# Altium schematic sheet LionIRVT-Power.SchDoc
size A3
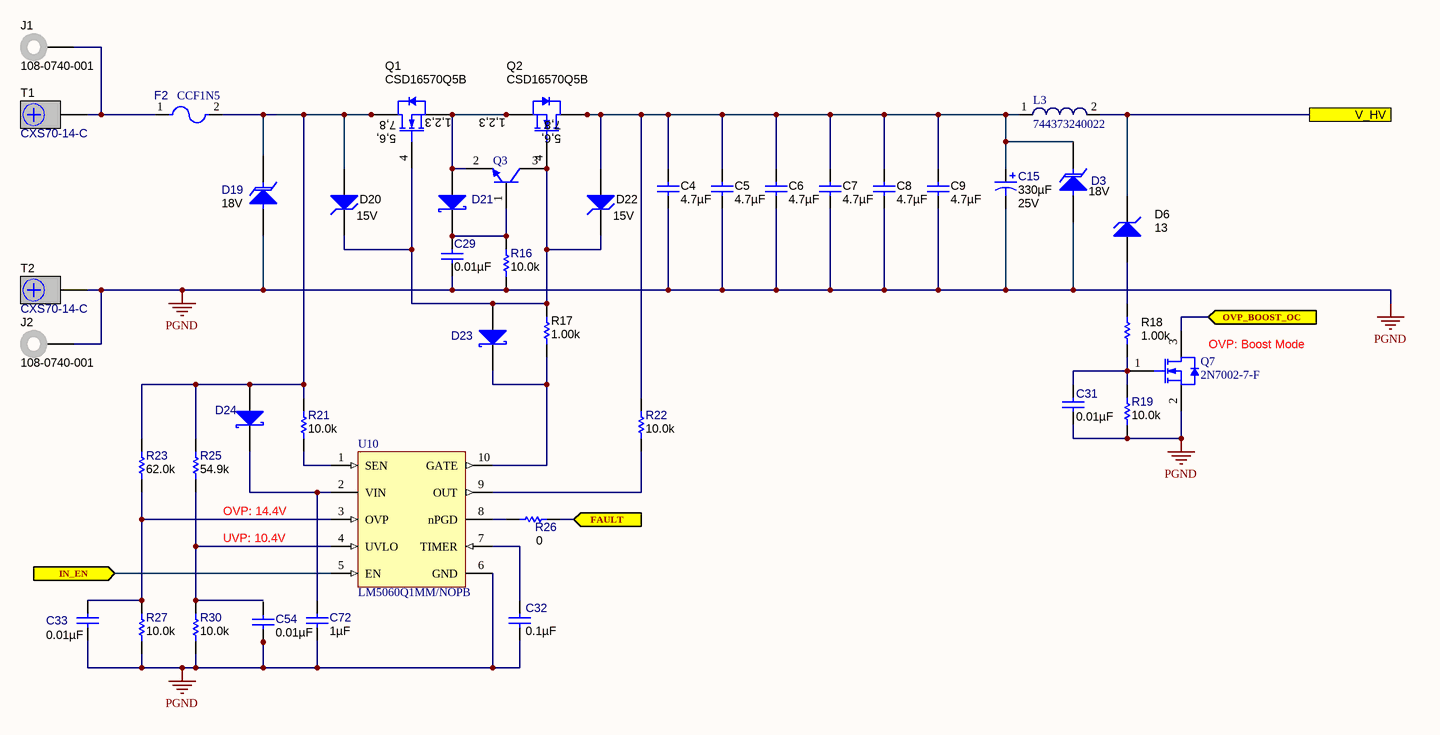
[diagram p0: LionIRVT-Power.SchDoc]

## Parts
C4  ValueDisplayed: 4.7µF  [2220_280]  (hidden comment: C5750X7R2A475M230KA)
C5  ValueDisplayed: 4.7µF  [2220_280]  (hidden comment: C5750X7R2A475M230KA)
C6  ValueDisplayed: 4.7µF  [2220_280]  (hidden comment: C5750X7R2A475M230KA)
C7  ValueDisplayed: 4.7µF  [2220_280]  (hidden comment: C5750X7R2A475M230KA)
C8  ValueDisplayed: 4.7µF  [2220_280]  (hidden comment: C5750X7R2A475M230KA)
C9  ValueDisplayed: 4.7µF  [2220_280]  (hidden comment: C5750X7R2A475M230KA)
C15  ValueDisplayed: 330µF  Value2: 25V  [CAPSMT_62_F12]  (hidden comment: 25SVPF330M)
C29  ValueDisplayed: 0.01µF  [0603C]  (hidden comment: GRM1885C1H103JA01D)
C31  ValueDisplayed: 0.01µF  [0603C]  (hidden comment: GRM1885C1H103JA01D)
C32  ValueDisplayed: 0.1µF  [0603C]  (hidden comment: C0603C104J3RACTU)
C33  ValueDisplayed: 0.01µF  [0603C]  (hidden comment: GRM1885C1H103JA01D)
C54  ValueDisplayed: 0.01µF  [0603C]  (hidden comment: GRM1885C1H103JA01D)
C72  ValueDisplayed: 1µF  [0603C]  (hidden comment: C0603C105K3RACTU)
D3  value 18V  [SMA]  (hidden comment: SMAJ18A)
D6  value 13  [sod-323]  (hidden comment: MMSZ5243BS-7-F)
D19  value 18V  [SMA]  (hidden comment: SMAJ18A)
D20  value 15V  [sod-323]  (hidden comment: MMSZ5245BS-7-F)
D21  NSR0240V2T1G  [SOD-523]  (value not drawn)
D22  value 15V  [sod-323]  (hidden comment: MMSZ5245BS-7-F)
D23  NSR0240V2T1G  [SOD-523]  (value not drawn)
D24  NSR0240V2T1G  [SOD-523]  (value not drawn)
F2  CCF1N5  [FUSE_CCF]
J1  108-0740-001  [Johnson_108-0740-001]
J2  108-0740-001  [Johnson_108-0740-001]
L3  744373240022  [WE-LHMI 4020]
Q1  CSD16570Q5B  [DNK8]
Q2  CSD16570Q5B  [DNK8]
Q3  MMBT2222ALT1G  [ONSC-SOT-23-3-318-08_V]  (value not drawn)
Q7  2N7002-7-F  [DIOD-SOT23-3_V]
R16  ValueDisplayed: 10.0k  [0603R]  (hidden comment: RC0603FR-0710KL)
R17  ValueDisplayed: 1.00k  [0603R]  (hidden comment: Resistor)
R18  ValueDisplayed: 1.00k  [0603R]  (hidden comment: Resistor)
R19  ValueDisplayed: 10.0k  [0603R]  (hidden comment: RC0603FR-0710KL)
R21  ValueDisplayed: 10.0k  [0603R]  (hidden comment: RC0603FR-0710KL)
R22  ValueDisplayed: 10.0k  [0603R]  (hidden comment: RC0603FR-0710KL)
R23  ValueDisplayed: 62.0k  [0603R]  (hidden comment: RC0603FR-0762KL)
R25  ValueDisplayed: 54.9k  [0603R]  (hidden comment: RC0603FR-0754K9L)
R26  ValueDisplayed: 0  [0603R]  (hidden comment: RC0603JR-070RL)
R27  ValueDisplayed: 10.0k  [0603R]  (hidden comment: RC0603FR-0710KL)
R30  ValueDisplayed: 10.0k  [0603R]  (hidden comment: RC0603FR-0710KL)
T1  CXS70-14-C  [Panduit_CXS70-14-C]
T2  CXS70-14-C  [Panduit_CXS70-14-C]
U10  LM5060Q1MM/NOPB  [DGS0010A_N]

## Ports
FAULT (in), IN_EN (in), OVP_BOOST_OC (in), V_HV

## Nets
PGND: C4.2 C5.2 C6.2 C7.2 C8.2 C9.2 C15.2(-) C29.2 C31.1 C32.1 C33.1 C54.1 C72.2 D3.2(A) D19.2(A) J2.1 Q7.2(S) R16.2 R19.2 R27.2 R30.2 T2.1 U10.6(GND)
FAULT: R26.1 ; port FAULT
IN_EN: U10.5(EN) ; port IN_EN
OVP_BOOST_OC: Q7.3(D) ; port OVP_BOOST_OC
V_HV: D6.1(K) L3.2 ; port V_HV
NetC4_1: C4.1 C5.1 C6.1 C7.1 C8.1 C9.1 C15.1(+) D3.1(K) D22.2(A) L3.1 Q2.5(D) Q2.6(D) Q2.7(D) Q2.8(D) R22.1
NetC29_1: C29.1 D21.1(K) Q3.1(B) R16.1
NetC31_2: C31.2 Q7.1(G) R18.1 R19.1
NetC32_2: C32.2 U10.7(TIMER)
NetC33_2: C33.2 R23.1 R27.1 U10.3(OVP)
NetC72_1: C72.1 D24.1(K) U10.2(VIN)
NetD6_2: D6.2(A) R18.2
NetD19_1: D19.1(K) D20.2(A) D24.2(A) F2.2 Q1.5(D) Q1.6(D) Q1.7(D) Q1.8(D) R21.1 R23.2 R25.2
NetD20_1: D20.1(K) D22.1(K) D23.2(A) Q1.4(G) Q2.4(G) Q3.3(C) R17.2
NetD21_2: D21.2(A) Q1.1(S) Q1.2(S) Q1.3(S) Q2.1(S) Q2.2(S) Q2.3(S) Q3.2(E)
NetD23_1: D23.1(K) R17.1 U10.10(GATE)
NetF2_1: F2.1 J1.1 T1.1
NetR21_2: R21.2 U10.1(SEN)
NetR22_2: R22.2 U10.9(OUT)
NetR25_1: R25.1 R30.1 U10.4(UVLO)
NetR26_2: R26.2 U10.8(nPGD)

Not connected (* = marked no-connect by the designer): C54 2

## Notes on the sheet
- (near Q7) OVP: Boost Mode
- (near R25) OVP: 14.4V
- UVP: 10.4V
- Title
- Size:
- Date:
- A3
- Number:
- Time:
- Revision:
- Sheet
- of
- File:
- (in symbol CSD16570Q5B) 7,8; 1,2,3; 5,6,

## Library data of the parts
C4-C9 = C5750X7R2A475M230KA: CAP, CERM, 4.7 µF, 100 V, +/- 20%, X7R, 2220; Manufacturer: TDK; Polarized: N; CompType: Capacitor; Value: 4.7uF; U/M: EA; Cap_F: 0.0000047; Tolerance_%: 20; ESR_ohm: 0.0015; Value1: 0.0015 ohm; VDC_V: 100; Value2: 100V; IRMS_A: 5.5; TaMin_C: -55; TaMax_C: 125; Cap_Case: 2220; AEC Category: Q200; SymbolVersion: 2008-07-09; PartNumber: C5750X7R2A475M230KA; PackageReference: 2220; RoHS: Y; MountType: SMT; Technology: Ceramic; TempCo: X7R; Published: 2008-06-19; Publisher: Texas Instruments; LatestRevisionDate: 2016-03-26; ComponentLink1Description: Datasheet link; ComponentLink1URL: http://www.tdk.co.jp/tefe02/e412_c.pdf; Supplier 1: Digi-Key; Supplier Part Number 1: 445-1450-1-ND; Supplier 2: Mouser; Supplier Part Number 2: 810-C5750X7R2A475M; Supplier 3: Farnell; Supplier Part Number 3: 1843193; AEC Qualified: N; AEC Grade: N/A
C15 = 25SVPF330M: CAP, Aluminum Polymer, 330 µF, 25 V, +/- 20%, 0.014 ohm, F12, SMD, 2-Leads, Body 10.5x10.5mm, Height 12.7mm SMD; Manufacturer: Panasonic; Polarized: Y; CompType: Capacitor; Value: 330uF; U/M: EA; Cap_F: 0.00033; Tolerance_%: 20; VDC_V: 25; ESR_ohm: 0.014; IRMS_A: 5; TaMin_C: -55; TaMax_C: 105; SizeAreaWB_mm2: 151.29; SizeArea_mm2: 106.09; SizeX_mm: 10.3; SizeZ_mm: 12.6; AEC Category: Q200; AEC Qualified: N; SymbolVersion: 2008-07-09; PartNumber: 25SVPF330M; PackageReference: F12, SMD, 2-Leads, Body 10.5x10.5mm, Height 12.7mm; RoHS: Y; Value1: 0.014 ohm; MountType: SMT; Technology: Aluminum Polymer; Series: SVPF; Cap_Case: F12; SizeY_mm: 10.3; Publisher: Texas Instruments; LatestRevisionDate: 2016-12-22; ComponentLink1Description: Datasheet link; ComponentLink1URL: http://industrial.panasonic.com/www-data/pdf/AAB8000/AAB8000CE1.pdf; AEC Grade: N/A
C29 C31 C33 C54 = GRM1885C1H103JA01D: CAP, CERM, 0.01 µF, 50 V, +/- 5%, C0G/NP0, 0603; Manufacturer: MuRata; Polarized: N; CompType: Capacitor; Value: 0.01uF; U/M: EA; Cap_F: 0.00000001; Tolerance_%: 5; Value1: Unknown; VDC_V: 50; Value2: 50V; TaMin_C: -55; TaMax_C: 125; Cap_Case: 0603; SizeArea_mm2: 1.28; SizeAreaWB_mm2: 4.68; SizeX_mm: 1.6; SizeY_mm: 0.8; SizeZ_mm: 1; AEC Category: Q200; SymbolVersion: 2008-07-09; PartNumber: GRM1885C1H103JA01D; PackageReference: 0603; RoHS: Y; MountType: SMT; Technology: Ceramic; TempCo: C0G/NP0; Published: 2008-06-19; Publisher: Texas Instruments; LatestRevisionDate: 2017-03-17; ComponentLink1Description: Datasheet link; ComponentLink1URL: http://search.murata.co.jp/Ceramy/image/img/A01X/G101/ENG/GRM1885C1H103JA01-01.pdf; Supplier 1: Digi-Key; Supplier Part Number 1: 490-9666-1-ND; Supplier 2: Newark; Supplier Part Number 2: 31Y1764; Supplier 3: Mouser; Supplier Part Number 3: 81-GRM1885C1H103JA1D; AEC Qualified: N; AEC Grade: N/A
C32 = C0603C104J3RACTU: CAP, CERM, 0.1 µF, 25 V, +/- 5%, X7R, 0603; Manufacturer: Kemet; Polarized: N; CompType: Capacitor; Value: 0.1uF; U/M: EA; Cap_F: 0.0000001; Tolerance_%: 5; Value1: Unknown; VDC_V: 25; Value2: 25V; TaMin_C: -55; TaMax_C: 125; Cap_Case: 0603; SizeArea_mm2: 1.28; SizeAreaWB_mm2: 4.68; SizeX_mm: 1.6; SizeY_mm: 0.8; SizeZ_mm: 1; AEC Category: Q200; SymbolVersion: 2008-07-09; PartNumber: C0603C104J3RACTU; PackageReference: 0603; RoHS: Y; MountType: SMT; Technology: Ceramic; TempCo: X7R; Published: 2008-06-19; Publisher: Texas Instruments; LatestRevisionDate: 2016-09-23; ComponentLink1Description: Datasheet link; ComponentLink1URL: http://www.kemet.com/kemet/web/homepage/kechome.nsf/vapubfiles/F3102_Y5V.pdf/$file/F3102_Y5V.pdf; Supplier 1: Digi-Key; Supplier Part Number 1: 399-1282-1-ND; Supplier 2: Mouser; Supplier Part Number 2: 80-C0603C104J3R; Supplier 3: Farnell; Supplier Part Number 3: 1650833; AEC Qualified: ?
C72 = C0603C105K3RACTU: CAP, CERM, 1 µF, 25 V, +/- 10%, X7R, 0603; Manufacturer: Kemet; Polarized: N; CompType: Capacitor; Value: 1uF; U/M: EA; Cap_F: 0.000001; Tolerance_%: 10; Value1: Unknown; VDC_V: 25; Value2: 25V; TaMin_C: -55; TaMax_C: 125; Cap_Case: 0603; SizeArea_mm2: 1.28; SizeAreaWB_mm2: 4.68; SizeX_mm: 1.6; SizeY_mm: 0.8; SizeZ_mm: 1; AEC Category: Q200; SymbolVersion: 2008-07-09; PartNumber: C0603C105K3RACTU; PackageReference: 0603; RoHS: Y; MountType: SMT; Technology: Ceramic; TempCo: X7R; Published: 2008-06-19; Publisher: Texas Instruments; LatestRevisionDate: 2016-09-23; ComponentLink1Description: Datasheet link; ComponentLink1URL: http://capacitoredge.kemet.com/capedge2/DataSheet/Datasheet-C0603C105K3RACTU.pdf?pn=C0603C105K3RACTU; Supplier 1: Digi-Key; Supplier Part Number 1: 399-7376-1-ND; Supplier 2: Mouser; Supplier Part Number 2: 80-C0603C105K3R; Supplier 3: Farnell; Supplier Part Number 3: 2118128; AEC Qualified: ?
D3 D19 = SMAJ18A: Diode, TVS, Uni, 18 V, 29.2 Vc, SMA; Manufacturer: Littelfuse; U/M: EA; Value1: 3.3W; Vr_V: 18; Power_W: 3.3; RJA_CperW: 120; AEC Category: Q101; AEC Qualified: N; SizeAreaWB_mm2: 37.3428; SizeArea_mm2: 16.3228; SizeX_mm: 5.59; SizeY_mm: 2.92; SizeZ_mm: 2.87; CompType: TVS; SymbolVersion: 2012-01-13; PartNumber: SMAJ18A; PackageReference: SMA; MountType: SMT; RoHS: Y; Published: 2008-10-08; Publisher: Texas Instruments; LatestRevisionDate: 2016-12-21; ComponentLink1Description: Datasheet link; ComponentLink1URL: http://www.littelfuse.com/~/media/electronics/datasheets/tvs_diodes/littelfuse_tvs_diode_smaj_datasheet.pdf.pdf; Supplier 1: Digi-Key; Supplier Part Number 1: SMAJ18ALFCT-ND; Supplier 2: Mouser; Supplier Part Number 2: 576-SMAJ18A; Supplier 3: Farnell; Supplier Part Number 3: 1787557; Vz_V: N/A; LatestRevisionNote: Updated Supplier Data
D6 = MMSZ5243BS-7-F: Diode, Zener, 13V, 200mW, SOD-323; Manufacturer: Diodes Inc.; U/M: EA; Power_W: 0.2; Value1: 0.2W; RJA_CperW: 350; CompType: Zener; SymbolVersion: 2010-08-25; PartNumber: MMSZ5243BS-7-F; PackageReference: SOD-323; Vr_V: N/A; Vz_V: 13; MountType: SMT; RoHS: Y; ComponentLink1Description: Datasheet link; ComponentLink1URL: http://www.diodes.com/datasheets/ds31038.pdf; Published: 2008-10-08; Publisher: Texas Instruments; LatestRevisionDate: 2013-07-05; LatestRevisionNote: Updated Supplier Data
D20 D22 = MMSZ5245BS-7-F: Diode, Zener, 15 V, 200 mW, SOD-323; Manufacturer: Diodes Inc.; SymbolCreator: a0412235; U/M: EA; Power_W: 0.2; Vz_V: 15; Value1: 0.2W; RJA_CperW: 350; SizeAreaWB_mm2: 8.695; SizeArea_mm2: 3.645; SizeX_mm: 2.7; SizeY_mm: 1.35; SizeZ_mm: 1; AEC Category: Q101; SymbolVersion: 2010-08-25; PartNumber: MMSZ5245BS-7-F; PackageReference: SOD-323; CompType: Zener; Vr_V: N/A; MountType: SMT; RoHS: Y; ComponentLink1Description: Datasheet link; ComponentLink1URL: http://www.diodes.com/datasheets/ds31038.pdf; Published: 2008-10-08; Publisher: Texas Instruments; LatestRevisionDate: 2017-03-18; LatestRevisionNote: Updated Supplier Data; Supplier 1: Digi-Key; Supplier Part Number 1: MMSZ5245BS-FDICT-ND; Supplier 2: Mouser; Supplier Part Number 2: 621-MMSZ5245BS-F; AEC Qualified: ?
D21 D23 D24 = NSR0240V2T1G: Diode, Schottky, 40V, 0.25A, SOD-523; Manufacturer: ON Semiconductor; U/M: EA; Vf_V: 0.7; Value2: 0.7V; Io_A: 0.25; Vr_V: 40; TJmax_C: 150; RJC_CperW: 600; CompType: Diode; SymbolVersion: 2008-12-08; PartNumber: NSR0240V2T1G; PackageReference: SOD-523; Value: 40V; Value1: 0.25A; MountType: SMT; Type: Schottky; RoHS: Y; Published: 2008-06-26; Publisher: Texas Instruments; LatestRevisionDate: 2014-07-21; ComponentLink1Description: Datasheet link; ComponentLink1URL: http://www.onsemi.com/pub_link/Collateral/NSR0240V2T1-D.PDF; Supplier 1: Digi-Key; Supplier Part Number 1: NSR0240V2T1GOSCT-ND; Supplier 2: Mouser; Supplier Part Number 2: 863-NSR0240V2T1G; Supplier 3: Newark; Supplier Part Number 3: 46P8323
F2 = FUSE_CCF1N_SERIES: Fuse, Fast Acting, 50VDC, 20A; Manufacturer: Koanet; Area: 46035; Value: LH-10; ComponentLink1URL: \\vette02\pmp_pcb\pcad_pdf's\ccf_fuse.pdf; ComponentHeight: 0.098 inch; PackageReference: 0.98 x 0.236 inch; SymbolVersion: 07/31/2009 12:17:29; PartNumber: CCF1N5; ComponentLink1Description: AEO Datasheet Link
J1 J2 = 108-0740-001: Standard Banana Jack, Uninsulated, 15A; Manufacturer: Emerson Network Power; SymbolCreator: a0412235; CompType: Connector; U/M: EA; SymbolVersion: 2009-09-23; PartNumber: 108-0740-001; PackageReference: Banana Jack; RoHS: Y; MountType: TH; ComponentLink1Description: Datasheet Link; ComponentLink1URL: http://emersonnetworkpower.com/webapp/wcs/stores/servlet/ESC/resources/1080740001.pdf; Publisher: Texas Instruments; LatestRevisionDate: 2014-11-22; Supplier 1: Digi-Key; Supplier Part Number 1: J147-ND; Supplier 2: Mouser; Supplier Part Number 2: 530-108-0740-1
L3 = CMP-1353-00034-1: SMD Power Inductor WE-LHMI, L=0.22 µH; Manufacturer: Wuerth Elektronik; Inductance: 0.22 ÂµH; ComponentLink1URL: http://www.we-online.com; ComponentLink2Description: Datasheet; PartNumber: 744373240022; PackageReference: WE-LHMI 4020; ComponentLink2URL: http://katalog.we-online.de/kataloge/eisos/media/pdf/744373240022.pdf; ComponentLink1Description: Manufacturer URL
Q1 Q2 = CSD16570Q5B: 25V, N ch NexFET MOSFET™, single SON5x6, 0.82mOhm; Manufacturer: Texas Instruments; Manufacturer Part Number: CSD16570Q5BT; CompType: MOSFET; Continuous Drain Current (ID): 100A; Rds On Max: 0.59mR; Input Capacitance: 14nF; Max Power Dissipation: 195W; Gate to Source Voltage (Vgs): 20V; Fall Time: 72ns; Rise Time: 43ns; Turn-Off Delay Time: 156ns; Turn-On Delay Time: 5ns; Threshold Voltage: 1.5V; Number of Channels: 1; SymbolVersion: 2008-07-09; Value: 25V; PartNumber: CSD16570Q5B; PackageReference: DNK0008A; ComponentLink1Description: Datasheet link; ComponentLink1URL: http://www.ti.com/lit/ds/symlink/csd17308q3.pdf; Supplier 1: Digi-Key; RoHS: Yes; Category: MOSFETs; Stock 1: 3774; Pricing 1: 1=2.43000, 10=2.18600, 25=2.06240, 100=1.60880 (USD); Mount: Surface Mount; Number of Pins: 8; Weight: 0.000847oz; Contact Plating: Gold; Min Operating Temperature: -55°C; Max Operating Temperature: 150°C; Packaging: Tape and Reel; Drain to Source Voltage (Vdss): 25V; Element Configuration: Single; Drain to Source Breakdown Voltage: 25V; Package Quantity: 250; Lead Free: Contains Lead; REACH SVHC: No SVHC; ComponentLink2URL: http://www.farnell.com/datasheets/1874868.pdf?src-supplier=Farnell; ComponentLink2Description: http://www.farnell.com/datasheets/1874868.pdf?src-supplier=Farnell; ComponentLink3URL: http://www.farnell.com/datasheets/2026550.pdf?src-supplier=Element14; ComponentLink3Description: http://www.farnell.com/datasheets/2026550.pdf?src-supplier=Element14; ComponentLink4URL: http://www.ti.com/lit/ds/symlink/csd16570q5b.pdf?src-supplier=Digi-Key; ComponentLink4Description: http://www.ti.com/lit/ds/symlink/csd16570q5b.pdf?src-supplier=Digi-Key; ComponentLink5URL: http://www.ti.com/general/docs/lit/getliterature.tsp?genericPartNumber=CSD16570Q5B&fileType=pdf&src-supplier=Farnell; ComponentLink5Description: http://www.ti.com/general/docs/lit/getliterature.tsp?genericPartNumber=CSD16570Q5B&fileType=pdf&src-supplier=Farnell; ComponentLink6URL: http://www.ti.com/general/docs/lit/getliterature.tsp?genericPartNumber=CSD16570Q5B&&fileType=pdf&src-supplier=Avnet; ComponentLink6Description: http://www.ti.com/general/docs/lit/getliterature.tsp?genericPartNumber=CSD16570Q5B&&fileType=pdf&src-supplier=Avnet; ComponentLink7URL: http://www.farnell.com/datasheets/1874868.pdf?src-supplier=Element14; ComponentLink7Description: http://www.farnell.com/datasheets/1874868.pdf?src-supplier=Element14; ComponentLink8URL: http://www.ti.com/lit/gpn/csd16570q5b?src-supplier=Mouser; ComponentLink8Description: http://www.ti.com/lit/gpn/csd16570q5b?src-supplier=Mouser; Supplier Part Number 1: 296-38335-1-ND
Q3 = CMP-1048-00538-1: General Purpose Transistor, NPN Silicon, 3-Pin SOT-23, Pb-Free, Tape and Reel; Manufacturer: On Semiconductor; fT Min (MHz): 300; IC Continuous (A): 0.6; ComponentLink3URL: http://www.onsemi.cn/pub_link/Collateral/318-08.PDF; PartNumber: MMBT2222ALT1G; RoHS: TRUE; ComponentLink1URL: http://www.onsemi.com/; ComponentLink3Description: Package Specification; ComponentLink2Description: Datasheet; Mounting Technology: Surface Mount; Packing: Tape and Reel; PackageDescription: 3-Pin Small Outline Transistor, Body 2.92 x 1.3 mm, Pitch 0.95 mm; DatasheetVersion: Rev. 10; PackageReference: SOT-23-3-318-08; ComponentLink2URL: http://www.onsemi.cn/pub_link/Collateral/MMBT2222LT1-D.PDF; Polarity: NPN; PackageVersion: Rev. AP, 11/2009; ComponentLink1Description: Manufacturer URL
Q7 = CMP-2000-04929-1: N-Channel Enhancement Mode Field Effect Transistor, 60 V, 0.115 A, -55 to 150 degC, 3-Pin SOT23, RoHS, Tape and Reel; Id - Continuous Drain Current: 115mA; Typical Turn-On Delay Time: 7ns; Typical Turn-Off Delay Time: 11ns; Brand: DiodesIncorporated; Transistor Type: 1N-Channel; Vgs - Gate-Source Voltage: 20V; Rise Time: 3ns; Configuration: Single; Fall Time: 5.6ns; Vds - Drain-Source Breakdown Voltage: 70V; Rds On - Drain-Source Resistance: 7.5Ohms; Number of Channels: 1Channel; Forward Transconductance - Min: 0.08S; Pd - Power Dissipation: 300mW; Unit Weight: 0.000282oz; Datasheet URL: http://datasheet.octopart.com/2N7002-7-F-Diodes-Inc.-datasheet-8326113.pdf; Width: 1.3mm; Series: 2N7002; Length: 2.9mm; Product Category: MOSFET; Minimum Operating Temperature: -55C; Manufacturer URL: http://www.diodes.com/; Mounting Style: SMD/SMT; Package Reference: SOT23-3; Package Description: 3-Pin Small Outline Transistor, Body 2.9 x 1.3 mm, Pitch 0.96 mm; Maximum Operating Temperature: +150C; Transistor Polarity: N-Channel; Factory Pack Quantity: 3000; Technology: Si; Channel Mode: Enhancement; Datasheet Version: Rev. 21-2, 02/2009; Type: EnhancementModeFieldEffectTransistor; RoHS: True; Packaging: Reel; Package / Case: SOT-23-3; Height: 1mm; Product: MOSFETSmallSignal; Manufacturer: DiodesIncorporated
R16 R19 R21 R22 R27 R30 = RC0603FR-0710KL: RES, 10.0 k, 1%, 0.1 W, 0603; Manufacturer: Yageo America; CompType: Resistor; Value: 10.0k; Res_ohm: 10000; Value_Code: 10k0; Tolerance_%: 1; Power_W: 0.1; Value2: 0.1W; VDC_V: 150; TempCo: 200 ppm/C; SizeArea_mm2: 1.28; SizeX_mm: 1.6; SizeY_mm: 0.8; EIA_Code: E96; U/M: EA; AEC Category: Q200; SymbolVersion: 2009-05-29; PartNumber: RC0603FR-0710KL; PackageReference: 0603; RoHS: Y; Value1: 1%; MountType: SMT; Technology: Thick Film; SizeZ_mm: 1; Published: 2008-06-26; Publisher: Texas Instruments; LatestRevisionDate: 2017-03-04; ComponentLink1Description: Datasheet link; ComponentLink1URL: http://www.yageo.com/pdf/Pu-RC0603_51_PbFree_L_2.pdf; Supplier 1: Digi-Key; Supplier Part Number 1: 311-10.0KHRCT-ND; Supplier 2: Mouser; Supplier Part Number 2: 603-RC0603FR-0710KL; Supplier 3: Farnell; Supplier Part Number 3: 9238603; AEC Qualified: ?
R17 R18 = CMP-0022109-5: RES, 1.00 k, 1%, 0.1 W, AEC-Q200 Grade 0, 0603; PartNumber: CRCW06031K00FKEA; Manufacturer: Vishay-Dale; Value: 1.00k; Res_ohm: 1k; Value_Code: 1k00; Power_W: 100mW; Value2: 0.1W; VDC_V: 75V; TempCo: 100 ppm/C; EIA_Code: E96; AEC Category: Q200; AEC Qualified: Y; AEC Grade: 0; SizeArea_mm2: 1.28; SizeX_mm: 1.6; SizeY_mm: 0.8; SizeZ_mm: 1; CompType: Resistor; PackageReference: 0603; RoHS: E; Tolerance_%: 1%; Value1: 1%; MountType: SMT; Technology: Thick Film; ComponentLink1Description: Datasheet link; ComponentLink1URL: http://www.vishay.com/docs/20035/dcrcwe3.pdf; Supplier 1: Digi-Key; Supplier Part Number 1: 541-1.00KHCT-ND; Supplier 2: Newark; Supplier Part Number 2: 52K8015; Supplier 3: Mouser; Supplier Part Number 3: 71-CRCW0603-1.0K-E3
R23 = RC0603FR-0762KL: RES, 62.0 k, 1%, 0.1 W, 0603; Manufacturer: Yageo America; CompType: Resistor; Value: 62.0k; Res_ohm: 62000; Value_Code: 62k0; Tolerance_%: 1; Power_W: 0.1; Value2: 0.1W; VDC_V: 150; TempCo: 200 ppm/C; SizeArea_mm2: 1.28; SizeX_mm: 1.6; SizeY_mm: 0.8; U/M: EA; AEC Category: Q200; SymbolVersion: 2009-05-29; PartNumber: RC0603FR-0762KL; PackageReference: 0603; RoHS: Y; Value1: 1%; MountType: SMT; Technology: Thick Film; SizeZ_mm: 1; Published: 2008-06-26; Publisher: Texas Instruments; LatestRevisionDate: 2016-09-18; ComponentLink1Description: Datasheet link; ComponentLink1URL: http://www.yageo.com/pdf/Pu-RC0603_51_PbFree_L_2.pdf; Supplier 1: Digi-Key; Supplier Part Number 1: 311-62.0KHRCT-ND; Supplier 2: Mouser; Supplier Part Number 2: 603-RC0603FR-0762KL; AEC Qualified: ?
R25 = RC0603FR-0754K9L: RES, 54.9 k, 1%, 0.1 W, 0603; Manufacturer: Yageo America; CompType: Resistor; Value: 54.9k; Res_ohm: 54900; Value_Code: 54k9; Tolerance_%: 1; Power_W: 0.1; Value2: 0.1W; VDC_V: 150; TempCo: 200 ppm/C; SizeArea_mm2: 1.28; SizeX_mm: 1.6; SizeY_mm: 0.8; EIA_Code: E96; U/M: EA; AEC Category: Q200; SymbolVersion: 2009-05-29; PartNumber: RC0603FR-0754K9L; PackageReference: 0603; RoHS: Y; Value1: 1%; MountType: SMT; Technology: Thick Film; SizeZ_mm: 1; Published: 2008-06-26; Publisher: Texas Instruments; LatestRevisionDate: 2016-09-18; ComponentLink1Description: Datasheet link; ComponentLink1URL: http://www.yageo.com/pdf/Pu-RC0603_51_PbFree_L_2.pdf; Supplier 1: Digi-Key; Supplier Part Number 1: 311-54.9KHRCT-ND; Supplier 2: Mouser; Supplier Part Number 2: 603-RC0603FR-0754K9L; AEC Qualified: ?
R26 = RC0603JR-070RL: RES, 0, 5%, 0.1 W, 0603; Manufacturer: Yageo America; CompType: Resistor; Value: 0; Value_Code: 0000; Tolerance_%: 5; Power_W: 0.1; Value2: 0.1W; VDC_V: 50; TempCo: 200 ppm/C; SizeArea_mm2: 1.28; SizeX_mm: 1.6; SizeY_mm: 0.8; SizeZ_mm: 1; EIA_Code: E24; U/M: EA; AEC Category: Q200; SymbolVersion: 2009-05-29; PartNumber: RC0603JR-070RL; PackageReference: 0603; RoHS: Y; Res_ohm: 0; Value1: 5%; MountType: SMT; Technology: Thick Film; Published: 2008-06-26; Publisher: Texas Instruments; LatestRevisionDate: 2016-09-18; ComponentLink1Description: Datasheet link; ComponentLink1URL: http://www.yageo.com/pdf/Pu-RC0603_51_PbFree_L_2.pdf; Supplier 1: Digi-Key; Supplier Part Number 1: 311-0.0GRCT-ND; Supplier 2: Mouser; Supplier Part Number 2: 603-RC0603JR-070RL; Supplier 3: Farnell; Supplier Part Number 3: 9233130; AEC Qualified: ?
T1 T2 = CXS70-14-C: Terminal 70A Lug; Manufacturer: Panduit; SymbolCreator: crossc; CompType: Screw Terminal; U/M: EA; SymbolVersion: 2009-10-14; PartNumber: CXS70-14-C; PackageReference: LUG, 32.3x14.5x11.7; RoHS: Y; MountType: TH; ComponentLink1Description: Datasheet Link; ComponentLink1URL: http://www.panduit.com/heiler/PartDrawings/C-PCCXS70-14-C--ENG.pdf; Publisher: Texas Instruments; LatestRevisionDate: 2014-11-22; Supplier 1: Digi-Key; Supplier Part Number 1: CXS70-14-C-ND; Supplier 2: Mouser; Supplier Part Number 2: 644-CXS70-14-C
U10 = CMP-0069-01835-4: High-Side Protection Controller with Low Quiescent Current, 10-pin MSOP, Pb-Free; Manufacturer: Texas Instruments; PackageTopMarking: ZXTT*SZAB; CompType: Switcher; High-Reliability: Y; PackageDescription: Mini-SO, Molded, .118 x .118 x .034in Body, 10 Lead, .0197in Pitch; PartNumber: LM5060Q1MM/NOPB; ComponentLink1URL: http://www.ti.com/general/docs/lit/getliterature.tsp?genericPartNumber=LM5060-Q1&fileType=pdf; Code_JEDEC: MO-187-BA; PackageReference: DGS0010A; PinCount: 10; RoHS: Y; PowerWise: Y; ComponentLink1Description: Datasheet URL